# EAGLE schematic ENERGIS-Display-Board-1.1.0 (EAGLE 9.2.1)
COMPANY: DvidMakesThings; REVISION: 1.1.0; WEB: https://github.com/DvidMakesThings/HW_10-In-Rack_PDU

## Sheet 1 of 3
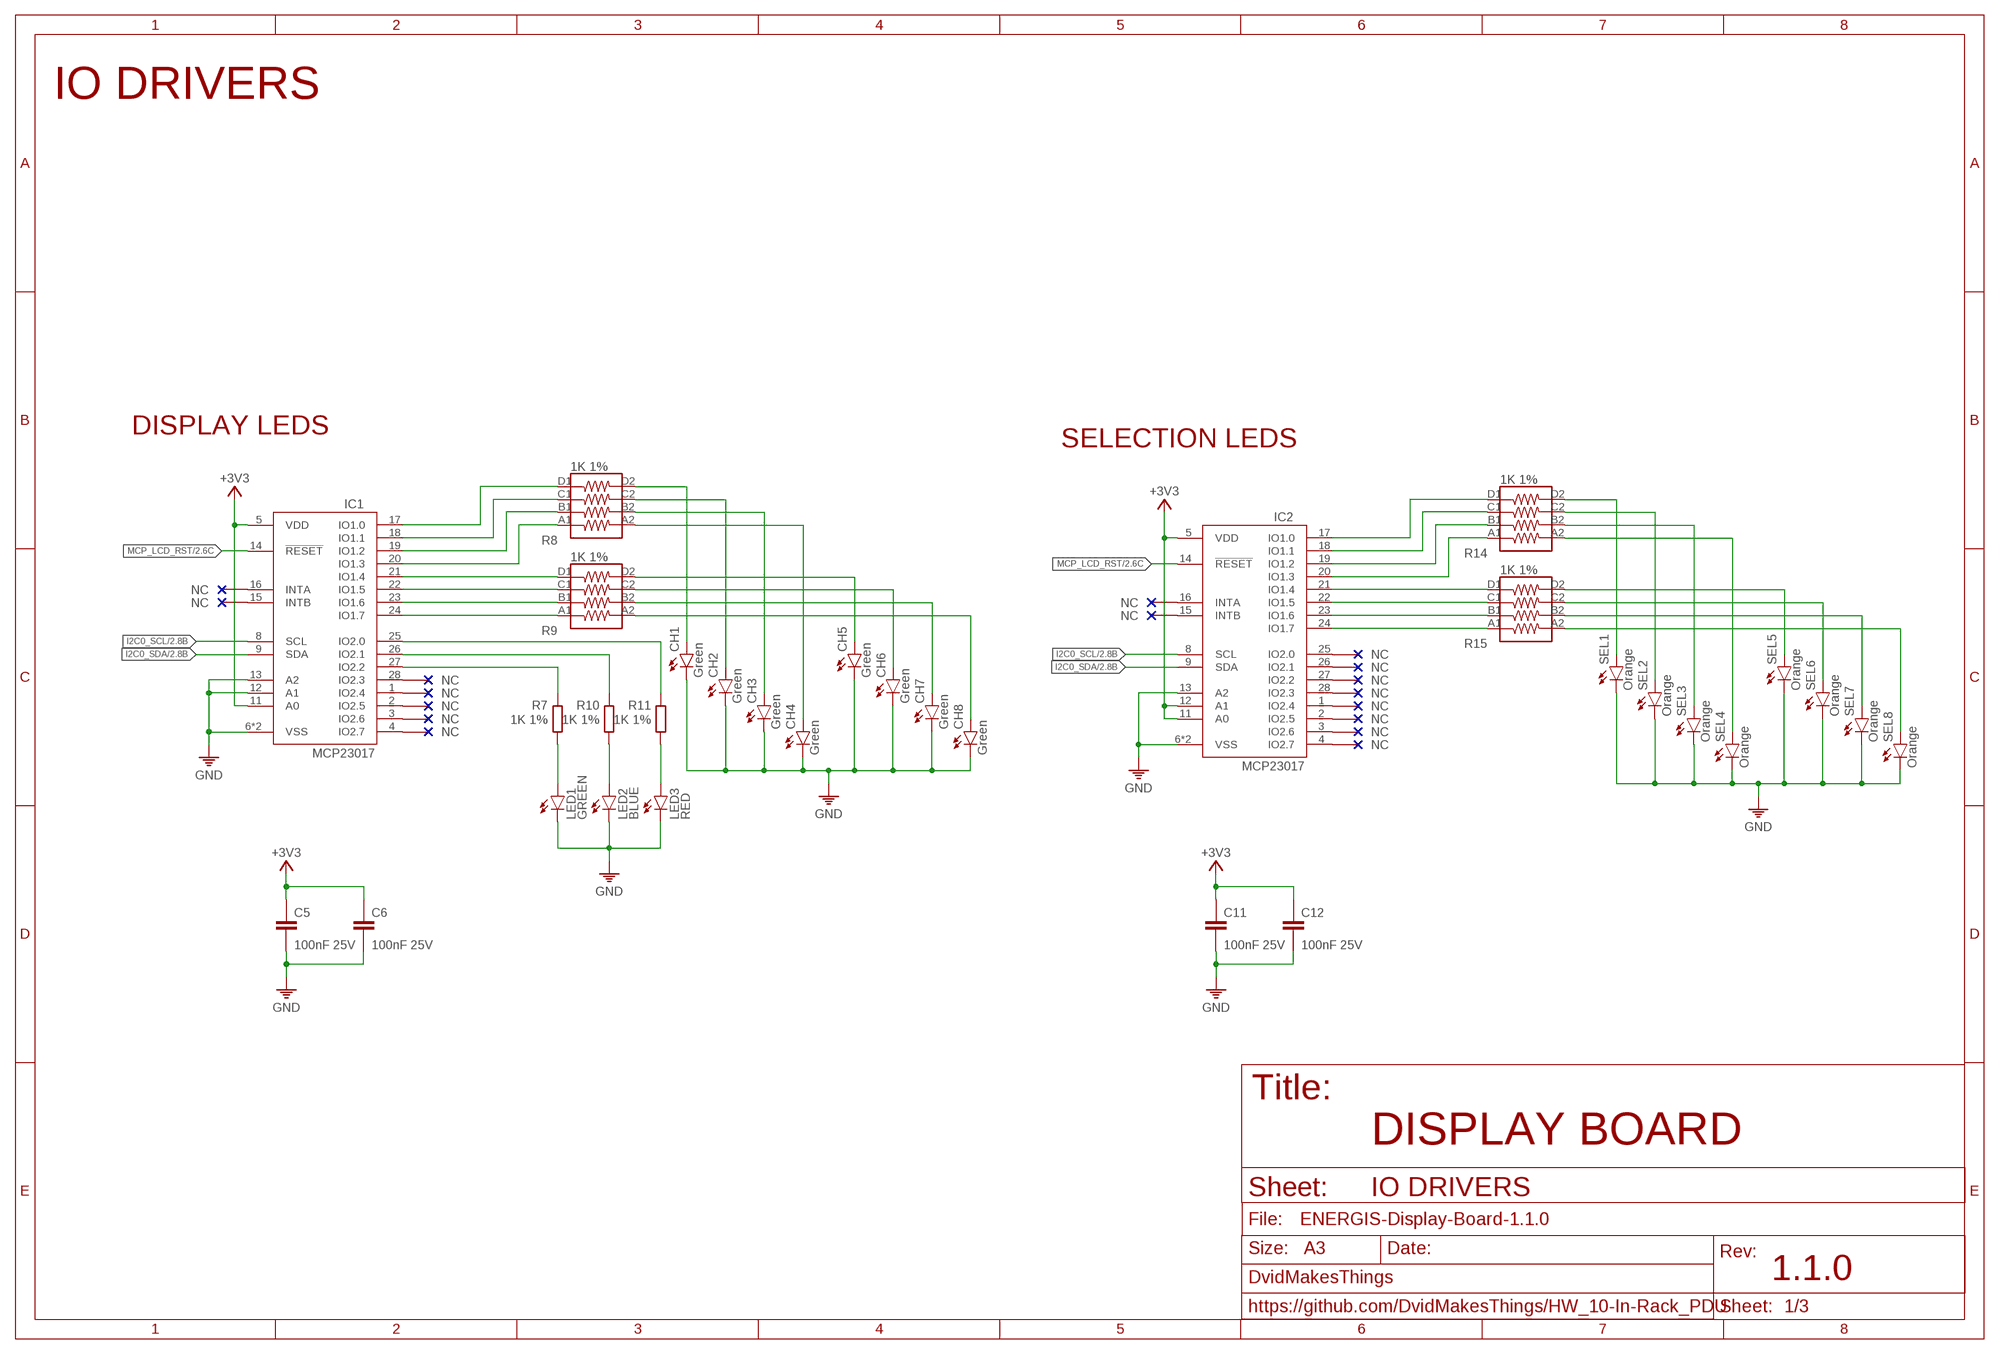
[diagram p0: schematic, sheet 1]

### Parts
C5  100nF 25V  100NF-25V-0402  [0402]
C6  100nF 25V  100NF-25V-0402  [0402]
C11  100nF 25V  100NF-25V-0402  [0402]
C12  100nF 25V  100NF-25V-0402  [0402]
CH1  Green  LED-GREENLED-0805  [LED-0805]
CH2  Green  LED-GREENLED-0805  [LED-0805]
CH3  Green  LED-GREENLED-0805  [LED-0805]
CH4  Green  LED-GREENLED-0805  [LED-0805]
CH5  Green  LED-GREENLED-0805  [LED-0805]
CH6  Green  LED-GREENLED-0805  [LED-0805]
CH7  Green  LED-GREENLED-0805  [LED-0805]
CH8  Green  LED-GREENLED-0805  [LED-0805]
IC1  MCP23017T-E/ML  MCP23017-E/ML  [QFN28[6X6]ML]
IC2  MCP23017T-E/ML  MCP23017-E/ML  [QFN28[6X6]ML]
LED1  GREEN  LED-GREEN3MM-CLEAR  [LED3MM]
LED2  BLUE  LED-BLUE3MM-CLEAR  [LED3MM]
LED3  RED  LED-RED3MM-CLEAR  [LED3MM]
R7  1K 1%  1K-1%0402  [0402]
R8  1K 1%  1K-1%_ARRAY0603X4-1206  [_0603X4-1206]
R9  1K 1%  1K-1%_ARRAY0603X4-1206  [_0603X4-1206]
R10  1K 1%  1K-1%0402  [0402]
R11  1K 1%  1K-1%0402  [0402]
R14  1K 1%  1K-1%_ARRAY0603X4-1206  [_0603X4-1206]
R15  1K 1%  1K-1%_ARRAY0603X4-1206  [_0603X4-1206]
SEL1  Orange  LED-ORANGELED-0805  [LED-0805]
SEL2  Orange  LED-ORANGELED-0805  [LED-0805]
SEL3  Orange  LED-ORANGELED-0805  [LED-0805]
SEL4  Orange  LED-ORANGELED-0805  [LED-0805]
SEL5  Orange  LED-ORANGELED-0805  [LED-0805]
SEL6  Orange  LED-ORANGELED-0805  [LED-0805]
SEL7  Orange  LED-ORANGELED-0805  [LED-0805]
SEL8  Orange  LED-ORANGELED-0805  [LED-0805]

### Nets
+3V3: C5.1 C6.1 C11.1 C12.1 IC1.5(VDD) IC1.11(A0) IC2.5(VDD) IC2.11(A0) IC2.12(A1) ; also sheet 2,3
GND: C5.2 C6.2 C11.2 C12.2 CH1.C CH2.C CH3.C CH4.C CH5.C CH6.C CH7.C CH8.C IC1.6(VSS) IC1.12(A1) IC1.13(A2) IC1.PAD(VSS) IC2.6(VSS) IC2.13(A2) IC2.PAD(VSS) LED1.K(C) LED2.K(C) LED3.K(C) SEL1.C SEL2.C SEL3.C SEL4.C SEL5.C SEL6.C SEL7.C SEL8.C ; also sheet 2,3
I2C0_SCL: IC1.8(SCL) IC2.8(SCL) ; also sheet 2
I2C0_SDA: IC1.9(SDA) IC2.9(SDA) ; also sheet 2
MCP_LCD_RST: IC1.14(!RESET) IC2.14(!RESET) ; also sheet 2
N$8: IC2.17(IO1.0) R14.D1
N$9: IC2.18(IO1.1) R14.C1
N$10: IC2.19(IO1.2) R14.B1
N$11: IC2.20(IO1.3) R14.A1
N$12: IC2.21(IO1.4) R15.D1
N$13: IC2.22(IO1.5) R15.C1
N$14: IC2.23(IO1.6) R15.B1
N$15: IC2.24(IO1.7) R15.A1
N$16: R14.D2 SEL1.A
N$17: R14.C2 SEL2.A
N$18: R14.B2 SEL3.A
N$19: R14.A2 SEL4.A
N$20: R15.D2 SEL5.A
N$21: R15.C2 SEL6.A
N$22: R15.B2 SEL7.A
N$23: R15.A2 SEL8.A
N$46: IC1.26(IO2.1) R10.1
N$47: IC1.27(IO2.2) R7.1
N$48: IC1.25(IO2.0) R11.1
N$50: IC1.17(IO1.0) R8.D1
N$51: IC1.18(IO1.1) R8.C1
N$52: IC1.19(IO1.2) R8.B1
N$53: IC1.20(IO1.3) R8.A1
N$54: IC1.21(IO1.4) R9.D1
N$55: IC1.22(IO1.5) R9.C1
N$56: IC1.23(IO1.6) R9.B1
N$57: IC1.24(IO1.7) R9.A1
N$58: CH1.A R8.D2
N$59: CH2.A R8.C2
N$60: CH3.A R8.B2
N$61: CH4.A R8.A2
N$62: CH5.A R9.D2
N$63: CH6.A R9.C2
N$64: CH7.A R9.B2
N$65: CH8.A R9.A2
N$66: LED3.A R11.2
N$67: LED2.A R10.2
N$68: LED1.A R7.2
Unconnected: IC1.1(IO2.4) IC1.2(IO2.5) IC1.3(IO2.6) IC1.4(IO2.7) IC1.15(INTB) IC1.16(INTA) IC1.28(IO2.3) IC2.1(IO2.4) IC2.2(IO2.5) IC2.3(IO2.6) IC2.4(IO2.7) IC2.15(INTB) IC2.16(INTA) IC2.25(IO2.0) IC2.26(IO2.1) IC2.27(IO2.2) IC2.28(IO2.3)

### Notes on the sheet
- IO DRIVERS
- DISPLAY LEDS
- SELECTION LEDS
- DISPLAY BOARD
- IO DRIVERS

## Sheet 2 of 3: CONNECTORS
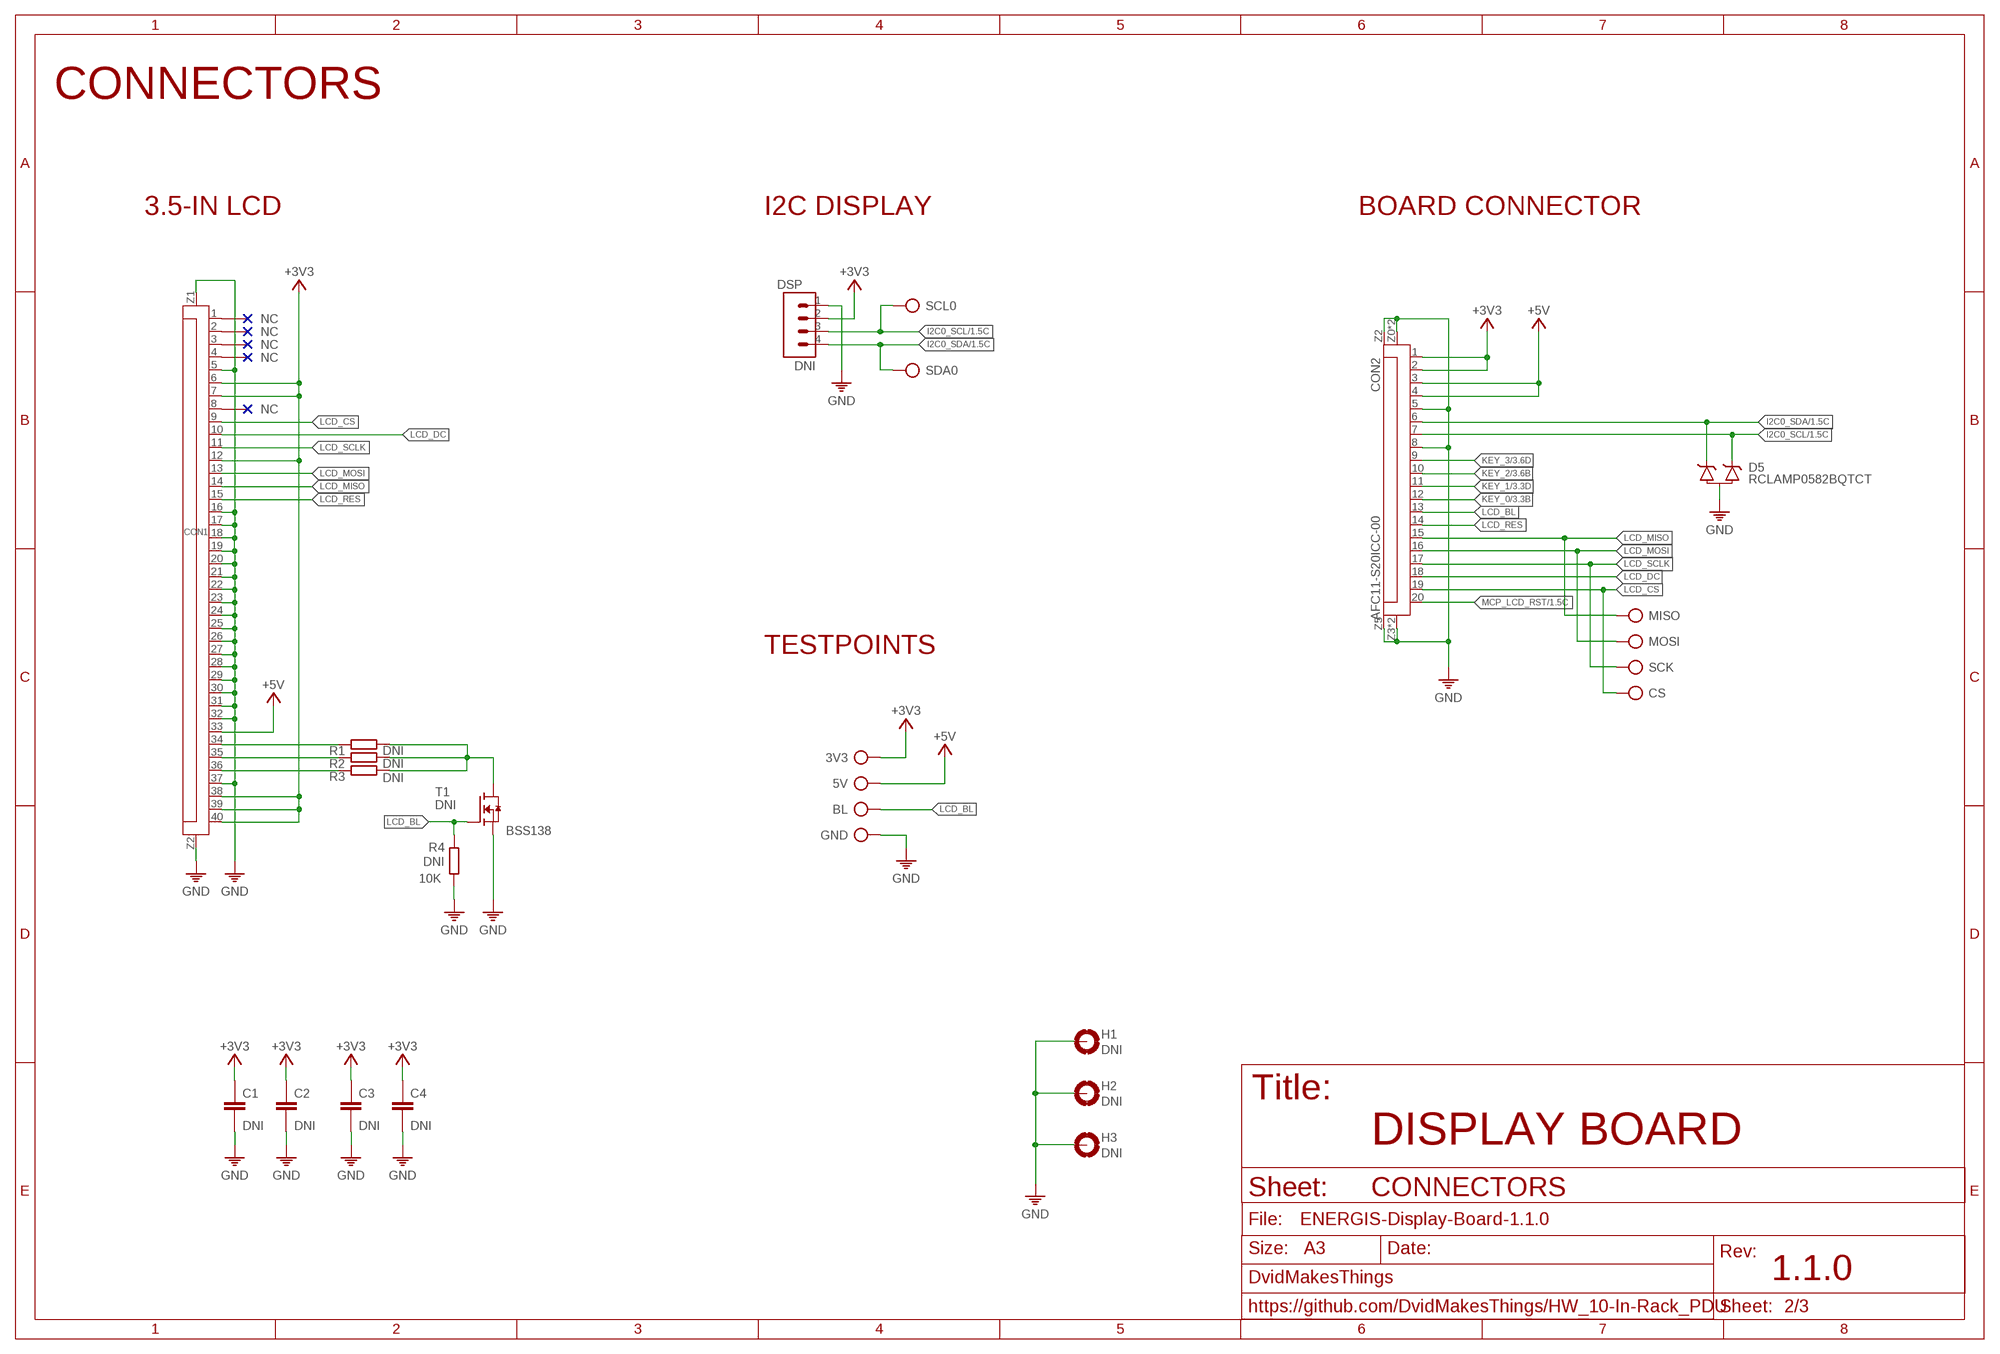
[diagram p1: schematic, sheet 2]

### Parts
3V3  DNI  TP-ROUND  [TP-ROUND]
5V  DNI  TP-ROUND  [TP-ROUND]
BL  DNI  TP-ROUND  [TP-ROUND]
C1  DNI  C-0402  [C0402]
C2  DNI  C-0402  [C0402]
C3  DNI  C-0402  [C0402]
C4  DNI  C-0402  [C0402]
CON1  DNI  FPC40-HD  [FPC40_3.5TFT]
CON2  AFC11-S20ICC-00  AFC11-S20ICC-00  [FPC20]
CS  DNI  TP-ROUND  [TP-ROUND]
D5  RCLAMP0582BQTCT  RCLAMP0582BQTCT-  [SC75]
DSP  DNI  CON-1X4  [1X4]
GND  DNI  TP-ROUND  [TP-ROUND]
H1  DNI  MOUNT-PAD-ROUND3.2  [3,2-PAD]
H2  DNI  MOUNT-PAD-ROUND3.2  [3,2-PAD]
H3  DNI  MOUNT-PAD-ROUND3.2  [3,2-PAD]
MISO  DNI  TP-ROUND  [TP-ROUND]
MOSI  DNI  TP-ROUND  [TP-ROUND]
R1  DNI  R0402  [0402]
R2  DNI  R0402  [0402]
R3  DNI  R0402  [0402]
R4  DNI  10K-1%0402  [0402]
SCK  DNI  TP-ROUND  [TP-ROUND]
SCL0  DNI  TP-ROUND  [TP-ROUND]
SDA0  DNI  TP-ROUND  [TP-ROUND]
T1  DNI  BSS138  [SOT23]

### Nets
+3V3: 3V3.TP C1.1 C2.1 C3.1 C4.1 CON1.6 CON1.7 CON1.12 CON1.38 CON1.39 CON1.40 CON2.1 CON2.2 DSP.2 ; also sheet 1,3
+5V: 5V.TP CON1.33 CON2.3 CON2.4
GND: C1.2 C2.2 C3.2 C4.2 CON1.5 CON1.16 CON1.17 CON1.18 CON1.19 CON1.20 CON1.21 CON1.22 CON1.23 CON1.24 CON1.25 CON1.26 CON1.27 CON1.28 CON1.29 CON1.30 CON1.31 CON1.32 CON1.37 CON1.Z1 CON1.Z2 CON2.5 CON2.8 CON2.Z0(Z1) CON2.Z1 CON2.Z2 CON2.Z3 CON2.Z4(Z3) CON2.Z5(Z4) D5.3 DSP.1 GND.TP H1.B3,2(MOUNT) H2.B3,2(MOUNT) H3.B3,2(MOUNT) R4.2 T1.2(S) ; also sheet 1,3
I2C0_SCL: CON2.7 D5.1 DSP.3 SCL0.TP ; also sheet 1
I2C0_SDA: CON2.6 D5.2 DSP.4 SDA0.TP ; also sheet 1
KEY_0: CON2.12 ; also sheet 3
KEY_1: CON2.11 ; also sheet 3
KEY_2: CON2.10 ; also sheet 3
KEY_3: CON2.9 ; also sheet 3
LCD_BL: BL.TP CON2.13 R4.1 T1.1(G)
LCD_CS: CON1.9 CON2.19 CS.TP
LCD_DC: CON1.10 CON2.18
LCD_MISO: CON1.14 CON2.15 MISO.TP
LCD_MOSI: CON1.13 CON2.16 MOSI.TP
LCD_RES: CON1.15 CON2.14
LCD_SCLK: CON1.11 CON2.17 SCK.TP
MCP_LCD_RST: CON2.20 ; also sheet 1
N$2: CON1.35 R2.2
N$3: CON1.36 R3.2
N$4: R1.1 R2.1 R3.1 T1.3(D)
N$5: CON1.34 R1.2
Unconnected: CON1.1 CON1.2 CON1.3 CON1.4 CON1.8

### Notes on the sheet
- CONNECTORS
- 3.5-IN LCD | I2C DISPLAY | BOARD CONNECTOR
- TESTPOINTS
- BSS138
- 10K
- DISPLAY BOARD
- CONNECTORS

## Sheet 3 of 3: PUSHBUTTONS
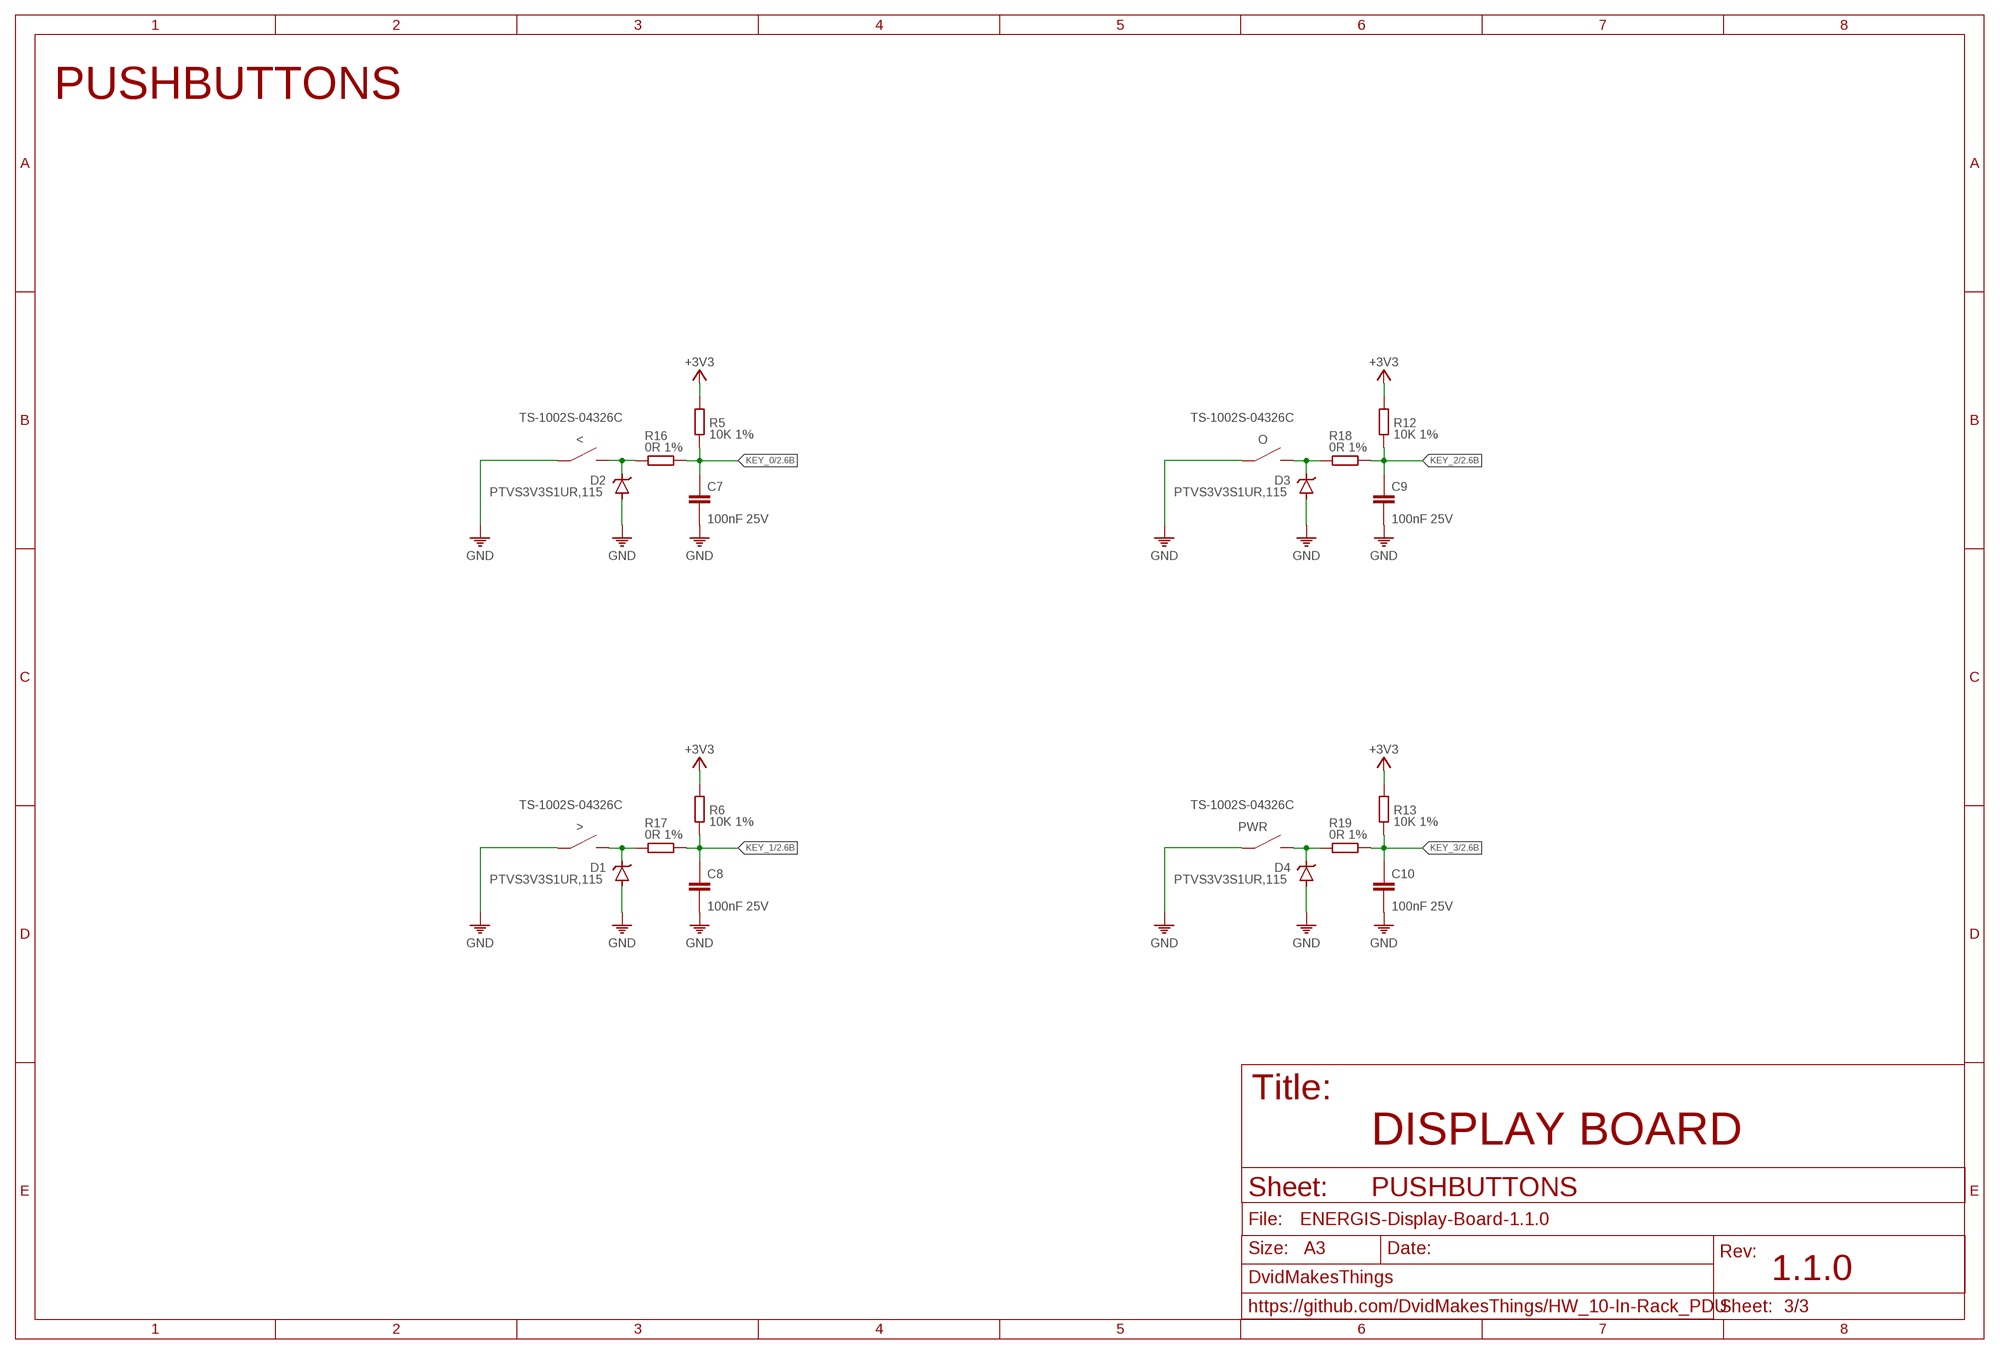
[diagram p2: schematic, sheet 3]

### Parts
<  TS-1002S-04326C  SWITCH6X6-SHORT  [PUSHBUTTON-6X6]
>  TS-1002S-04326C  SWITCH6X6-SHORT  [PUSHBUTTON-6X6]
C7  100nF 25V  100NF-25V-0402  [0402]
C8  100nF 25V  100NF-25V-0402  [0402]
C9  100nF 25V  100NF-25V-0402  [0402]
C10  100nF 25V  100NF-25V-0402  [0402]
D1  PTVS3V3S1UR,115  PTVS3V3S1UR,115  [SOD-123]
D2  PTVS3V3S1UR,115  PTVS3V3S1UR,115  [SOD-123]
D3  PTVS3V3S1UR,115  PTVS3V3S1UR,115  [SOD-123]
D4  PTVS3V3S1UR,115  PTVS3V3S1UR,115  [SOD-123]
O  TS-1002S-04326C  SWITCH6X6-SHORT  [PUSHBUTTON-6X6]
PWR  TS-1002S-04326C  SWITCH6X6-SHORT  [PUSHBUTTON-6X6]
R5  10K 1%  10K-1%0402  [0402]
R6  10K 1%  10K-1%0402  [0402]
R12  10K 1%  10K-1%0402  [0402]
R13  10K 1%  10K-1%0402  [0402]
R16  0R 1%  0R0402  [0402]
R17  0R 1%  0R0402  [0402]
R18  0R 1%  0R0402  [0402]
R19  0R 1%  0R0402  [0402]

### Nets
+3V3: R5.1 R6.1 R12.1 R13.1 ; also sheet 1,2
GND: <.1 <.2 >.1 >.2 C7.2 C8.2 C9.2 C10.2 D1.A D2.A D3.A D4.A O.1 O.2 PWR.1 PWR.2 ; also sheet 1,2
KEY_0: C7.1 R5.2 R16.2 ; also sheet 2
KEY_1: C8.1 R6.2 R17.2 ; also sheet 2
KEY_2: C9.1 R12.2 R18.2 ; also sheet 2
KEY_3: C10.1 R13.2 R19.2 ; also sheet 2
N$7: <.3 <.4 D2.C R16.1
N$24: D3.C O.3 O.4 R18.1
N$25: D4.C PWR.3 PWR.4 R19.1
N$26: >.3 >.4 D1.C R17.1

### Notes on the sheet
- PUSHBUTTONS
- DISPLAY BOARD
- PUSHBUTTONS

## Library data of the parts
3V3 5V BL CS GND MISO MOSI SCK SCL0 SDA0 = ds_passive:TP; ROHS: YES
< > O PWR = ds_passive:SWITCH; DESCRIPTION: 6mm 4.3mm Round Button 50mA Standing paste 6mm SPST 12V SMD,6x6mm Tactile Switches ROHS; HQ_PART: SW0049370; LCSC_PART: C455108; MANUFACTURER: USAKRO; MPN: UK-B0228G43-SP25; ROHS: YES
C1-C4 = ds_passive:C
C5-C12 = ds_capacitors:100NF-25V; DESCRIPTION: 25V 100nF ±10% 0402 Multilayer Ceramic Capacitors MLCC - SMD/SMT ROHS; HQ_PART: CA0176807; LCSC_PART: C56392; MANUFACTURER: Walsin; MPN: 0402X104K250CT; ROHS: YES
CH1-CH8 = ds_LED:LED-GREEN; DESCRIPTION: Emerald 0805 LED Indication - Discrete ROHS; HQ_PART: PH0094653; LCSC_PART: C2297; MANUFACTURER: MEIHUA; MPN: MHT170UGCT; ROHS: YES
CON1 = ds_con:FPC40-H
CON2 = ds_con:AFC11-S20ICC-00: Drawer Type 20P Single-sided contact points/Vertical Standing paste 0.5mm SMD,P=0.5mm FFC, FPC (Flat Flexible) Connector Assemblies ROHS; DESCRIPTION: Drawer Type 20P Single-sided contact points/Vertical Standing paste 0.5mm SMD,P=0.5mm FFC, FPC (Flat Flexible) Connector Assemblies ROHS; HQ_PART: CO0889517; LCSC_PART: C11073; MANUFACTURER: JS; MPN: AFC11-S20ICA-00; ROHS: YES
D1-D4 = ds_diode:PTVS3V3S1UR,115: 400 W unidirectional Transient Voltage Suppressor (TVS) in a SOD123W small and flat lead low-profile Surface-Mounted Device (SMD) plastic package, designed for transient overvoltage protection.; DATASHEET: https://assets.nexperia.com/documents/data-sheet/PTVSXS1UR_SER.pdf; DESCRIPTION: 3.3V 350W@10/1000us 43.8A@10/1000us 5.6V 5uA 8V IEC 61000-4-2 TVS Unidirectional SOD-123W ESD and Surge Protection (TVS/ESD) ROHS; HQ_PART: CP0009318; LCSC_PART: C183521; MANUFACTURER: Nexperia; MPN: PTVS3V3S1UR,115; ROHS: YES
D5 = ds_diode:RCLAMP0582BQTCT: The RailClamp0582BQ is a 5V, dual-line, low-capacitance automotive-grade RailClamp transient voltage suppressor (TVS) optimized for safeguarding high-speed data ports, such as Ethernet and USB, from electrostatic discharge (ESD) threats. The low-capacitance and high ESD robustness of the RClamp0582BQ make it an ideal protection device for safeguarding automotive-based data lines from harsh ESD spikes.; DATASHEET: https://semtech.my.salesforce.com/sfc/p/#E0000000JelG/a/440000001Lzx/0M5l0VFdFhBLS7TSRfd1I2V77GSkvtksC9b.1bnFtjQ; HQ_PART: PD0007296; LCSC_PART: C841193; MANUFACTURER: SEMTECH; MPN: RCLAMP0582BQTCT; ROHS: YES
DSP = ds_con:CON-1X4
H1-H3 = holes:MOUNT-PAD-ROUND: MOUNTING PAD, round
IC1 IC2 = ds_ic_peripherals:MCP23017: 16-Bit I2C I/O Expander with Serial Interface; DATASHEET: https://ww1.microchip.com/downloads/en/devicedoc/20001952c.pdf; DESCRIPTION: 1.7MHz I2C QFN-28-EP(6x6) I/O Expanders ROHS; HQ_PART: IC0080215; LCSC_PART: C629439; MANUFACTURER: MICROCHIP; MPN: MCP23017-E/ML; ROHS: YES
LED1 = ds_LED:LED-GREEN; DESCRIPTION: -20℃~+80℃ 20mA 30° 3mm Round Lens 600nm~610nm 610nm 72mW Amber Water Clear Plugin,D=3mm LED Indication - Discrete ROHS; HQ_PART: PH0094890; LCSC_PART: C414645; MANUFACTURER: MEIHUA; MPN: MHL3014UGTD; ROHS: YES
LED2 = ds_LED:LED-BLUE; DESCRIPTION: 3mm Round Lens Blue Plugin,D=3mm LED Indication - Discrete ROHS; HQ_PART: PH0094706; LCSC_PART: C86881; MANUFACTURER: MEIHUA; MPN: MHL3014UBTD; ROHS: YES
LED3 = ds_LED:LED-RED; DESCRIPTION: -20℃~+80℃ 20mA 30° 3mm Round Lens Red Water Clear Plugin,D=3mm LED Indication - Discrete ROHS; HQ_PART: PH0094690; LCSC_PART: C330752; MANUFACTURER: MEIHUA; MPN: MHL3014SRTS; ROHS: YES
R1-R3 = ds_passive:R
R4 = ds_resistor:10K-1%; DESCRIPTION: 62.5mW Thick Film Resistors 50V ±100ppm/℃ ±1% 10kΩ 0402 Chip Resistor - Surface Mount ROHS; HQ_PART: RE0207399; LCSC_PART: C25744; MANUFACTURER: ROHM; MPN: MCR01MZPF1002; ROHS: YES; VALUE: 10K 1%
R5 R6 R12 R13 = ds_resistor:10K-1%; DESCRIPTION: 62.5mW Thick Film Resistors 50V ±100ppm/℃ ±1% 10kΩ 0402 Chip Resistor - Surface Mount ROHS; HQ_PART: RE0207399; LCSC_PART: C25744; MANUFACTURER: ROHM; MPN: MCR01MZPF1002; ROHS: YES
R7 R10 R11 = ds_resistor:1K-1%; DESCRIPTION: 62.5mW Thick Film Resistors 50V ±100ppm/℃ ±1% 1kΩ 0402 Chip Resistor - Surface Mount ROHS; HQ_PART: RE0208724; LCSC_PART: C11702; MANUFACTURER: FH; MPN: RC-02K1001FT; ROHS: YES
R8 R9 R14 R15 = ds_resistor:1K-1%_ARRAY; DESCRIPTION: 4 ±1% 1kΩ 62.5mW ±200ppm/℃ 0603x4 Resistor Networks, Arrays ROHS; HQ_PART: RE0022532; LCSC_PART: C110021; MANUFACTURER: Yageo; MPN: YC164-JR-071KL; ROHS: YES
R16-R19 = ds_resistor:0R; DESCRIPTION: 62.5mW Thick Film Resistors 50V ±800ppm/℃ ±1% 0Ω 0402 Chip Resistor - Surface Mount ROHS; HQ_PART: RE0250181; LCSC_PART: C17168; MANUFACTURER: YAGEO; MPN: RC0402JR-130RL; ROHS: YES
SEL1-SEL8 = ds_LED:LED-ORANGE; DESCRIPTION: 10mA Colorless transparent lens -40℃~+85℃ 598nm~608nm Orange 120° 40mW 0805 LED Indication - Discrete ROHS; HQ_PART: PH0093712; LCSC_PART: C434437; MANUFACTURER: NATIONSTAR; MPN: FC-2012YOXK(5)-600H08; ROHS: YES
T1 = ds_active:BSS138; DESCRIPTION: 50V 230mA 3.4Ω@10V,220mA 230mW 1.5V@250uA N Channel SOT-23-3 MOSFETs ROHS; HQ_PART: DS0190318; MANUFACTURER: HUASHUO; MPN: BSS138; ROHS: YES; VALUE: BSS138

## Net classes
0 default: width 0.173 mm, drill 0.35 mm, clearance 0.191 mm